# Altium schematic sheet UART_to_USB-OTG_USB.SchDoc
size A4
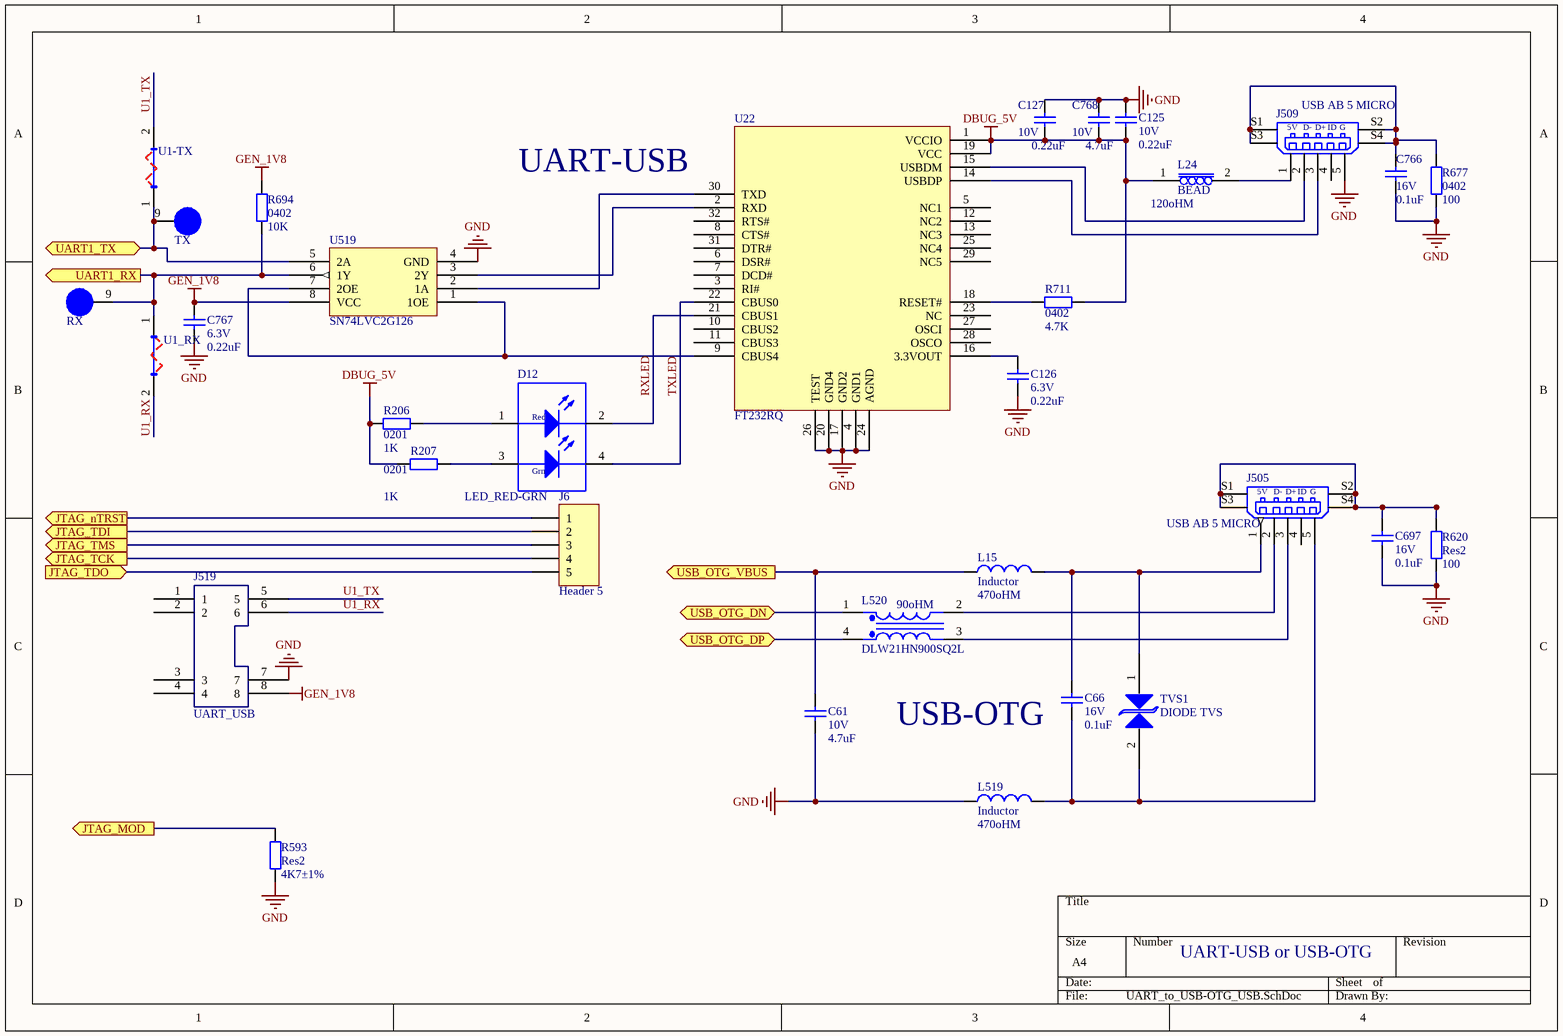
[diagram p0: UART_to_USB-OTG_USB.SchDoc]

## Parts
C61  10V  value 4.7uF  [0603]
C66  16V  value 0.1uF  [0402]
C125  10V  value 0.22uF  [0201]
C126  6.3V  value 0.22uF  [0201]
C127  10V  value 0.22uF  [0201]
C697  16V  value 0.1uF  [0402]
C766  16V  value 0.1uF  [0402]
C767  6.3V  value 0.22uF  [0201]
C768  10V  value 4.7uF  [0603]
D12  LED_RED-GRN  [APB3025ESGC-F01-SMT]
J6  Header 5  [HDR1X5]
J505  USB AB 5 MICRO  [micro-USB-port]
J509  USB AB 5 MICRO  [micro-USB-port]
J519  UART_USB  [DC3-8]
L15  Inductor  value 470oHM  [0603]
L24  BEAD  [0603]
L519  Inductor  value 470oHM  [0603]
L520  DLW21HN900SQ2L  [DLW21HN900SQ2L-0805]
R206  0201  value 1K  [0201]
R207  0201  value 1K  [0201]
R593  Res2  value 4K7±1%  [0402]
R620  Res2  value 100  [0402]
R677  0402  value 100  [0402]
R694  0402  value 10K  [0402]
R711  0402  value 4.7K  [0402]
RX  TP test  [TP]  (value not drawn)
TVS1  DIODE TVS  [ESD9B3.3ST5G-SOD923]
TX  TP test  [TP]  (value not drawn)
U1-TX  SHORT  [SHORT_SH]  (value not drawn)
U1_RX  SHORT  [SHORT_SH]  (value not drawn)
U22  FT232RQ  [FT232RQ-QFN32]
U519  SN74LVC2G126  [SN74LVC2G126-SSOP8]

## Ports
JTAG_MOD (out), JTAG_nTRST (out), JTAG_TCK (out), JTAG_TDI (out), JTAG_TDO (in), JTAG_TMS (out), UART1_RX (out), UART1_TX, USB_OTG_DN, USB_OTG_DP, USB_OTG_VBUS (out)

## Nets
DBUG_5V: C125.2 C127.2 C768.1 L24.1(VSS3) R206.1 R207.1 R711.2 U22.1(VCCIO) U22.19(VCC)
GEN_1V8: C767.1 J519.8 R694.2 U519.8(VCC)
GND: C61.1 C125.1 C126.2 C127.1 C697.1 C766.1 C767.2 C768.2 J509.5(GND) J519.7 L519.1 R593.1 R620.1 R677.1 U22.4(GND1) U22.17(GND2) U22.20(GND4) U22.24(AGND) U22.26(TEST) U519.4(GND)
JTAG_MOD: R593.2 ; port JTAG_MOD
JTAG_nTRST: J6.1 ; port JTAG_nTRST
JTAG_TCK: J6.4 ; port JTAG_TCK
JTAG_TDI: J6.2 ; port JTAG_TDI
JTAG_TDO: J6.5 ; port JTAG_TDO
JTAG_TMS: J6.3 ; port JTAG_TMS
RXLED: D12.2(GND) U22.21(CBUS1)
TXLED: D12.4(GND) U22.22(CBUS0)
U1_RX: J519.6 U1_RX.2(VCCIO)
U1_TX: J519.5 U1-TX.2(VCCIO)
UART1_RX: R694.1 RX.9(S) U1_RX.1(VCCIO) U519.6(1Y) ; port UART1_RX
UART1_TX: TX.9(S) U1-TX.1(VCCIO) U519.5(2A) ; port UART1_TX
USB_OTG_DN: L520.1(VSS11) ; port USB_OTG_DN
USB_OTG_DP: L520.4(VSS14) ; port USB_OTG_DP
USB_OTG_VBUS: C61.2 L15.1 ; port USB_OTG_VBUS
NetC66_1: C66.1 J505.5(GND) L519.2 TVS1.2(VSS5)
NetC66_2: C66.2 J505.1(GND) L15.2 TVS1.1(VSS6)
NetC126_1: C126.1 U22.16(3.3VOUT)
NetC697_2: C697.2 J505.S1 J505.S2 J505.S3 J505.S4 R620.2
NetC766_2: C766.2 J509.S1 J509.S2 J509.S3 J509.S4 R677.2
NetD12_1: D12.1(GND) R206.2
NetD12_3: D12.3(GND) R207.2
NetJ505_2: J505.2(GND) L520.2(VSS12)
NetJ505_3: J505.3(GND) L520.3(VSS13)
NetJ509_1: J509.1(GND) L24.2(VSS4)
NetJ509_2: J509.2(GND) U22.15(USBDM)
NetJ509_3: J509.3(GND) U22.14(USBDP)
NetR711_1: R711.1 U22.18(RESET#)
NetU22_2: U22.2(RXD) U519.3(2Y)
NetU22_9: U22.9(CBUS4) U519.1(1OE) U519.7(2OE)
NetU22_30: U22.30(TXD) U519.2(1A)

Not connected (* = marked no-connect by the designer): J505 4(GND); J509 4(GND); J519 1 2 3 4; U22 3(RI#) 5(NC1) 6(DSR#) 7(DCD#) 8(CTS#) 10(CBUS2) 11(CBUS3) 12(NC2) 13(NC3) 23(NC) 25(NC4) 27(OSCI) 28(OSCO) 29(NC5) 31(DTR#) 32(RTS#)

## Notes on the sheet
- UART-USB
- USB-OTG
- UART-USB or USB-OTG
- (in symbol APB3025ESGC-F01) Red; Grn
- (in symbol DLW21HN900SQ2L) 90oHM
- (in symbol magnetic BEAD) 120oHM
- (in symbol USB AB 5 MICRO) 5V; D-; D+; ID; G

## Library data of the parts
C61 C66 C125-C127 C697 C766-C768 = Cap: Capacitor; Published: 8-Jun-2000; LatestRevisionDate: 17-Jul-2002; LatestRevisionNote: Re-released for DXP Platform.; PackageReference: RAD-0.3; Publisher: Altium Limited
D12 = APB3025ESGC-F01
J6 = Header 5: Header, 5-Pin; LatestRevisionDate: 17-Jul-2002; LatestRevisionNote: Re-released for DXP Platform.; Publisher: Altium Limited
J519 = JTAG_hornsocket8P
L15 L519 = Inductor: Code_IEC: 1005; Published: 8-Jun-2000; LatestRevisionDate: 29-May-2009; LatestRevisionNote: IPC-7351 Footprint Added.; PackageReference: 0402-A; Publisher: Altium Limited; PackageDescription: Chip Inductor; Code_JEITA: 0402
L24 = magnetic BEAD
R206 R207 R593 R620 R677 R694 R711 = Res2: Resistor; Published: 8-Jun-2000; LatestRevisionDate: 17-Jul-2002; LatestRevisionNote: Re-released for DXP Platform.; PackageReference: AXIAL-0.4; Publisher: Altium Limited
U1-TX U1_RX = SOLDER SHORT